# EAGLE design untitled (EAGLE 9.6.2)
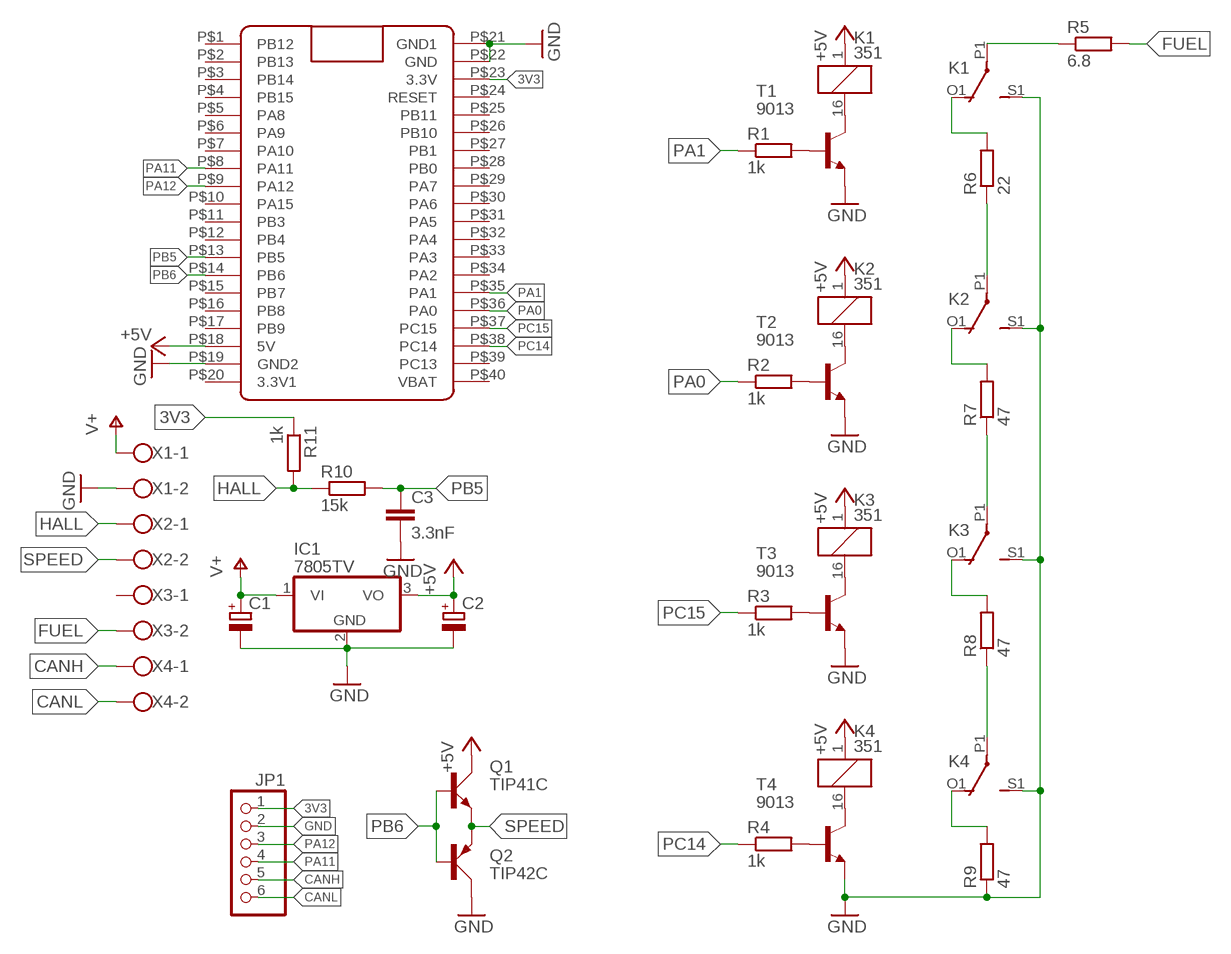
[diagram p0: schematic, sheet 1]

## Parts
C1  CPOL-EUE5-10.5  [E5-10,5]
C2  CPOL-EUE5-10.5  [E5-10,5]
C3  3.3nF  C-EU050-024X044  [C050-024X044]
IC1  7805TV  [TO220V]
JP1  PINHD-1X6  [1X06]
K1  351  [351]
K2  351  [351]
K3  351  [351]
K4  351  [351]
Q1  TIP41C  [TO220AV]
Q2  TIP42C  [TO220AV]
R1  1k  R-EU_0207/7  [0207/7]
R2  1k  R-EU_0207/7  [0207/7]
R3  1k  R-EU_0207/7  [0207/7]
R4  1k  R-EU_0207/7  [0207/7]
R5  6.8  R-EU_0207/7  [0207/7]
R6  22  R-EU_0207/7  [0207/7]
R7  47  R-EU_0207/7  [0207/7]
R8  47  R-EU_0207/7  [0207/7]
R9  47  R-EU_0207/7  [0207/7]
R10  15k  R-EU_0207/7  [0207/7]
R11  1k  R-EU_0207/7  [0207/7]
T1  9013  -NPN-TO92-EBC  [TO92-EBC]
T2  9013  -NPN-TO92-EBC  [TO92-EBC]
T3  9013  -NPN-TO92-EBC  [TO92-EBC]
T4  9013  -NPN-TO92-EBC  [TO92-EBC]
U$1  BLUE_PILL  [BLUE_PILL]
X1  W237-102  [W237-102]
X2  W237-102  [W237-102]
X3  W237-102  [W237-102]
X4  W237-102  [W237-102]

## Nets
3V3: JP1.1 R11.1 U$1.P$23(3.3V)
+5V: C2.+ IC1.3(VO) K1.1 K2.1 K3.1 K4.1 Q1.C U$1.P$18(5V)
CANH: JP1.5 X4.1
CANL: JP1.6 X4.2
FUEL: R5.2 X3.2
GND: C1.- C2.- C3.2 IC1.2(GND) JP1.2 K1.S1(2:S) K2.S1(2:S) K3.S1(2:S) K4.S1(2:S) Q2.C R9.1 T1.E T2.E T3.E T4.E U$1.P$19(GND2) U$1.P$21(GND1) U$1.P$22(GND) X1.2
HALL: R10.1 R11.2 X2.1
N$1: K1.P1(2:P) R5.1
N$3: K1.16 T1.C
N$4: R1.2 T1.B
N$5: K2.16 T2.C
N$6: R2.2 T2.B
N$7: K3.16 T3.C
N$8: R3.2 T3.B
N$9: K4.16 T4.C
N$10: R4.2 T4.B
N$11: K2.P1(2:P) R6.1
N$12: K1.O1(2:O) R6.2
N$13: K3.P1(2:P) R7.1
N$14: K2.O1(2:O) R7.2
N$15: K4.P1(2:P) R8.1
N$16: K3.O1(2:O) R8.2
N$18: K4.O1(2:O) R9.2
PA0: R2.1 U$1.P$36(PA0)
PA1: R1.1 U$1.P$35(PA1)
PA11: JP1.4 U$1.P$8(PA11)
PA12: JP1.3 U$1.P$9(PA12)
PB5: C3.1 R10.2 U$1.P$13(PB5)
PB6: Q1.B Q2.B U$1.P$14(PB6)
PC14: R4.1 U$1.P$38(PC14)
PC15: R3.1 U$1.P$37(PC15)
SPEED: Q1.E Q2.E X2.2
V+: C1.+ IC1.1(VI) X1.1
Unconnected: K1.O2(3:O) K1.P2(3:P) K1.S2(3:S) K2.O2(3:O) K2.P2(3:P) K2.S2(3:S) K3.O2(3:O) K3.P2(3:P) K3.S2(3:S) K4.O2(3:O) K4.P2(3:P) K4.S2(3:S) U$1.P$1(PB12) U$1.P$2(PB13) U$1.P$3(PB14) U$1.P$4(PB15) U$1.P$5(PA8) U$1.P$6(PA9) U$1.P$7(PA10) U$1.P$10(PA15) U$1.P$11(PB3) U$1.P$12(PB4) U$1.P$15(PB7) U$1.P$16(PB8) U$1.P$17(PB9) U$1.P$20(3.3V1) U$1.P$24(RESET) U$1.P$25(PB11) U$1.P$26(PB10) U$1.P$27(PB1) U$1.P$28(PB0) U$1.P$29(PA7) U$1.P$30(PA6) U$1.P$31(PA5) U$1.P$32(PA4) U$1.P$33(PA3) U$1.P$34(PA2) U$1.P$39(PC13) U$1.P$40(VBAT) X3.1

## Library data of the parts
C1 C2 = rcl:CPOL-EU: POLARIZED CAPACITOR, European symbol; SPICEPREFIX: C
C3 = rcl:C-EU: CAPACITOR, European symbol; SPICEPREFIX: C
IC1 = linear:78*: Positive VOLTAGE REGULATOR Source: http://cache.national.com/ds/LM/LM78L05.pdf http://www.fairchildsemi.com/ds/LM/LM7805.pdf
JP1 = pinhead:PINHD-1X6: PIN HEADER
K1-K4 = relay:351: RELAY 2 x switch, Omron; OC_FARNELL: unknown; OC_NEWARK: unknown
Q1 = transistor-power:TIP41C: NPN TRANSISTOR
Q2 = transistor-power:TIP42C: PNP TRANSISTOR
R1-R11 = rcl:R-EU_: RESISTOR, European symbol; SPICEPREFIX: R
T1-T4 = transistor:*-NPN-: NPN Transistror BF959 corrected 2008.03.06
U$1 = BluePill:BLUE_PILL
X1-X4 = con-wago-500:W237-102: WAGO SCREW CLAMP; MPN: 237-102; OC_FARNELL: unknown; OC_NEWARK: 70K9898

## Board
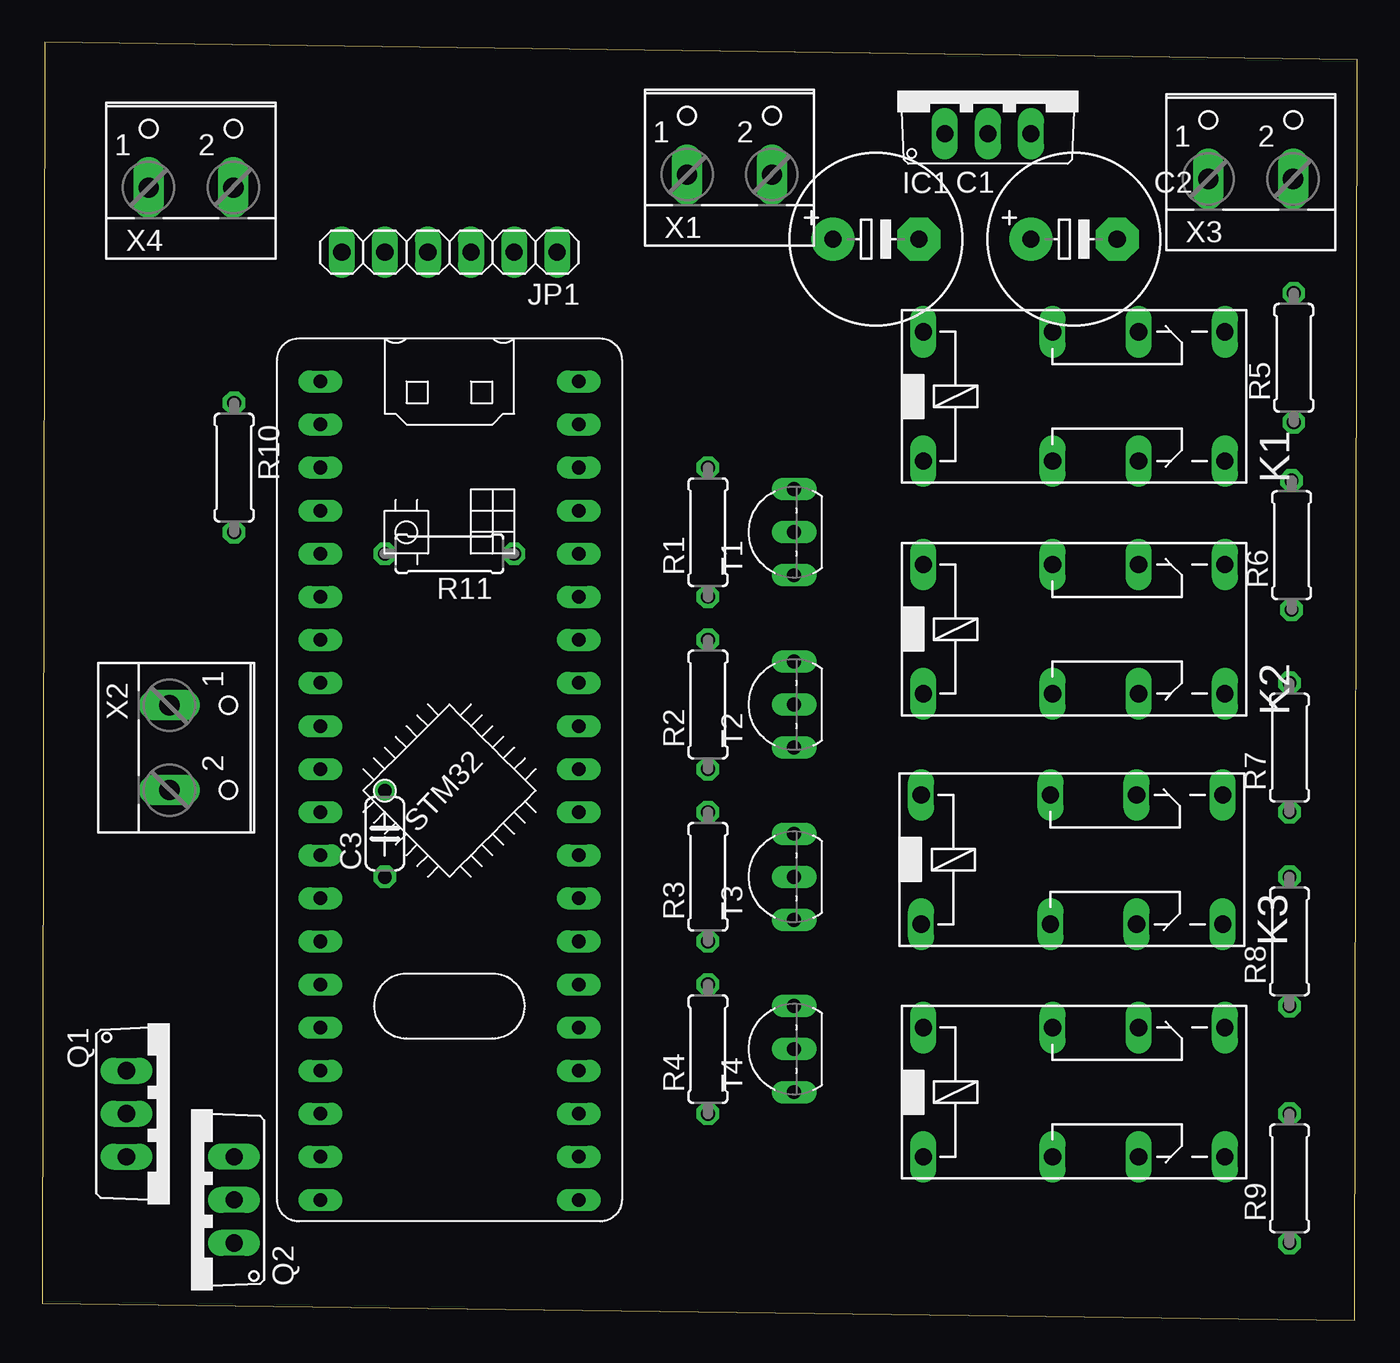
[diagram p1: board, top side]
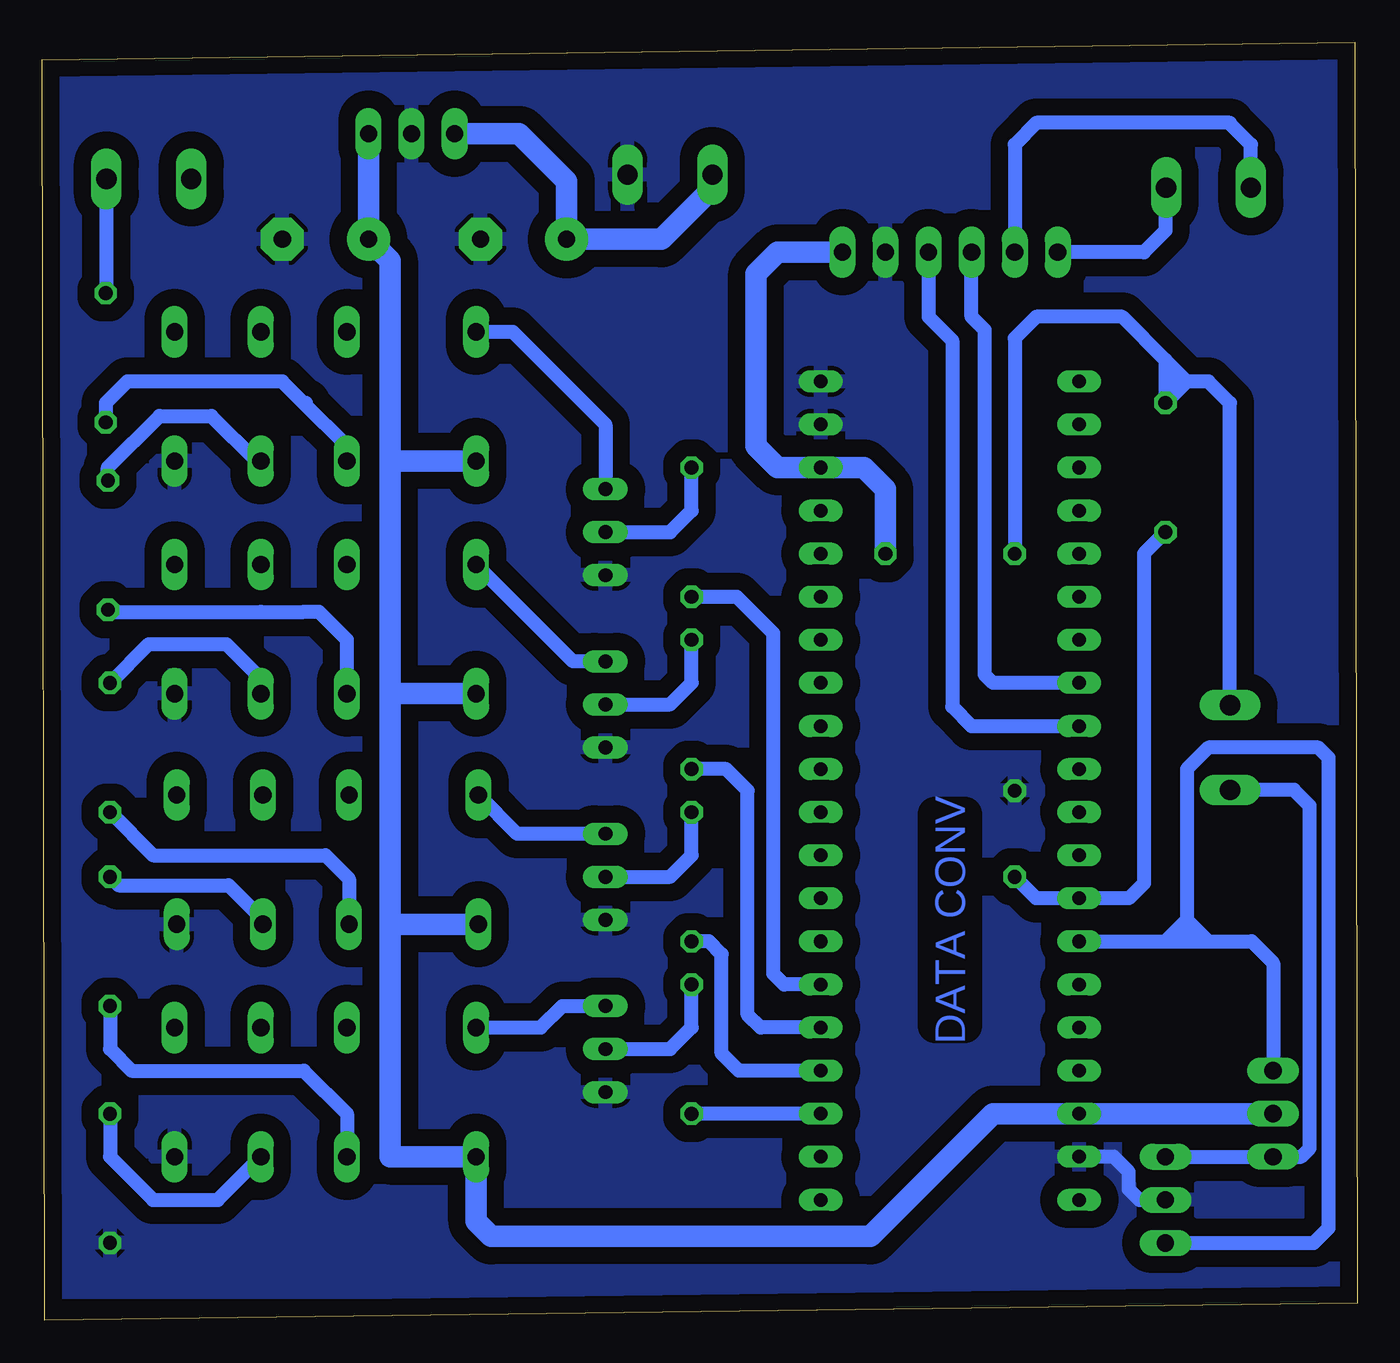
[diagram p2: board, bottom side, seen from below]

Size 77.52 x 75.36 mm. Coordinates in mm from the lower left corner, seen from the top.
Outline: 0,1.02 77.39,0 77.52,74.35 0.13,75.36 0,1.02
Copper layers (1*16): Top 0.035mm / dielectric 1.5mm / Bottom 0.035mm
Design rules "default": minimum track width 6mil, minimum drill 0.35mm, track to track 6mil, track to pad 6mil, pad to pad 6mil, via to via 6mil, smd to smd 6mil, copper to edge 40mil, drill to drill 6mil, minimum pad ring 10mil, minimum via ring 8mil, stop-mask expansion 4mil, vias tented up to drill 0mil, thermal gap 10mil

### Footprints (pad centres in the part's own frame; a part is rotated, then mirrored left to right if it is on the bottom)
E5-10,5 = drill 1.016 pad 2.54: + -2.54,0 | drill 1.016 pad 2.54 octagon: - 2.54,0
C050-024X044 = drill 0.813 octagon: 1 -2.54,0; 2 2.54,0
TO220V = drill 1.016 long: 1 -2.54,-2.54; 2 0,-2.54; 3 2.54,-2.54
1X06 = drill 1.016 long: 1 -6.35,0; 2 -3.81,0; 3 -1.27,0; 4 1.27,0; 5 3.81,0; 6 6.35,0
351 = drill 1.016 long: 1 -3.81,-3.81; 16 -3.81,3.81; O1 8.89,-3.81; O2 8.89,3.81; P1 3.81,-3.81; P2 3.81,3.81; S1 13.97,-3.81; S2 13.97,3.81
TO220AV = drill 1.016 long: B -2.54,-2.54; C 0,-2.54; E 2.54,-2.54
0207/7 = drill 0.813 octagon: 1 -3.81,0; 2 3.81,0
TO92-EBC = drill 0.813 long: B 0,-1.27; C 2.54,-1.27; E -2.54,-1.27
BLUE_PILL = drill 0.8 long: P$1 -7.62,15.24; P$2 -7.62,12.7; P$3 -7.62,10.16; P$4 -7.62,7.62; P$5 -7.62,5.08; P$6 -7.62,2.54; P$7 -7.62,0; P$8 -7.62,-2.54; P$9 -7.62,-5.08; P$10 -7.62,-7.62; P$11 -7.62,-10.16; P$12 -7.62,-12.7; P$13 -7.62,-15.24; P$14 -7.62,-17.78; P$15 -7.62,-20.32; P$16 -7.62,-22.86; P$17 -7.62,-25.4; P$18 -7.62,-27.94; P$19 -7.62,-30.48; P$20 -7.62,-33.02; P$21 7.62,15.24; P$22 7.62,12.7; P$23 7.62,10.16; P$24 7.62,7.62; P$25 7.62,5.08; P$26 7.62,2.54; P$27 7.62,0; P$28 7.62,-2.54; P$29 7.62,-5.08; P$30 7.62,-7.62; P$31 7.62,-10.16; P$32 7.62,-12.7; P$33 7.62,-15.24; P$34 7.62,-17.78; P$35 7.62,-20.32; P$36 7.62,-22.86; P$37 7.62,-25.4; P$38 7.62,-27.94; P$39 7.62,-30.48; P$40 7.62,-33.02
W237-102 = drill 1.194 long: 1 -2.5,-1.27; 2 2.5,-1.27

### Placement (x,y rotation side)
C1  49.15,63.75 0 top
C2  60.83,63.75 0 top
C3  20.19,28.7 90 top
IC1  55.75,72.52 0 top
JP1  24,62.99 180 top
K1  55.75,54.48 0 top
K2  55.75,40.77 0 top
K3  55.63,27.18 0 top
K4  55.75,13.46 0 top
Q1  7.49,12.19 270 top
Q2  8.76,7.11 90 top
R1  39.24,46.48 90 top
R2  39.24,36.32 90 top
R3  39.24,26.16 90 top
R4  39.24,16 90 top
R5  73.79,56.77 90 top
R6  73.66,45.72 90 top
R7  73.53,33.78 90 top
R8  73.53,22.35 90 top
R9  73.53,8.38 90 top
R10  11.3,50.29 270 top
R11  24,45.21 180 top
T1  43.05,46.48 90 top
T2  43.05,36.32 90 top
T3  43.05,26.16 90 top
T4  43.05,16 90 top
U$1  24,40.13 0 top
X1  40.51,68.83 0 top
X2  8.76,33.78 270 top
X3  71.25,68.58 0 top
X4  8.76,68.07 0 top

### Tracks (layer width: path | path; a pad name or v marks a point on that pad's centre or on a via)
3V3
  Bottom 1.27: JP1.1 34.16,62.99 35.43,61.72 35.43,51.56 34.16,50.29 U$1.P$23 29.08,50.29 27.81,49.02 R11.1
+5V
  Bottom 1.27: IC1.3 C2.+ 57.02,62.48 57.02,50.67 | 57.02,36.96 57.02,23.37 | 57.02,23.37 57.02,9.65 K4.1 51.94,5.84 51.05,4.95 28.7,4.95 21.46,12.19 U$1.P$18 Q1.C | K2.1 57.02,36.96 | K3.1 57.02,23.37 | 57.02,36.96 57.02,50.67 | K1.1 57.02,50.67
CANH
  Bottom 0.813: X4.1 6.26,69.34 7.49,70.57 7.49,70.61 18.92,70.61 20.19,69.34 JP1.5
CANL
  Bottom 0.813: X4.2 11.3,66.76 11.3,64.26 12.57,62.99 JP1.6
FUEL
  Bottom 0.813: X3.2 73.75,60.62 R5.2
GND
  Bottom 0.813: Q2.C 12.83,7.11 13.46,7.75 13.46,8.76 14.35,9.65 U$1.P$19
  pour Bottom (isolate 1.016): -0.13,74.42 -0.13,1.65 76.84,1.65 76.84,74.42
HALL
  Bottom 0.813: 7.53,36.32 X2.1 7.49,54.1 8.76,55.37 10.03,55.37 | R11.2 20.19,57.91 18.92,59.18 13.84,59.18 11.3,56.64 | 11.3,56.64 11.3,55.37 | 11.3,55.37 R10.1 10.03,55.37 | 11.3,55.37 10.03,55.37 | 10.03,55.37 11.3,56.64
N$1
  Bottom 0.813: R5.1 73.79,54.1 72.52,55.37 63.37,55.37 62.1,54.1 | 62.1,54.1 61.98,54.1 | 59.56,51.69 K1.P1 59.56,51.56 62.1,54.1
N$3
  Bottom 0.813: T1.C 44.32,52.83 49.78,58.29 K1.16
N$4
  Bottom 0.813: T1.B 40.51,46.48 39.24,47.75 R1.2
N$5
  Bottom 0.813: K2.16 46.23,38.86 T2.C
N$6
  Bottom 0.813: T2.B 40.51,36.32 39.24,37.59 R2.2
N$7
  Bottom 0.813: T3.C 49.53,28.7 K3.16
N$8
  Bottom 0.813: T3.B 40.51,26.16 39.24,27.43 R3.2
N$9
  Bottom 0.813: K4.16 48.13,17.27 46.86,18.54 T4.C
N$10
  Bottom 0.813: T4.B 40.51,16 39.24,17.27 R4.2
N$11
  Bottom 0.813: R6.1 73.53,41.78 64.64,41.78 62.1,41.78 61.21,41.78 59.56,40.13 K2.P1
N$12
  Bottom 0.813: R6.2 73.66,50.29 70.61,53.34 67.56,53.34 64.9,50.67 K1.O1
N$13
  Bottom 0.813: R7.1 70.99,27.43 60.83,27.43 59.44,26.04 K3.P1
N$14
  Bottom 0.813: R7.2 71.25,39.88 66.67,39.88 64.64,37.85 K2.O1
N$15
  Bottom 0.813: R8.1 73.53,16 72.26,14.73 62.1,14.73 59.56,12.19 K4.P1
N$16
  Bottom 0.813: R8.2 73.03,25.65 66.55,25.65 64.52,23.62 K3.O1
N$18
  Bottom 0.813: K4.O1 67.18,7.11 70.99,7.11 73.53,9.65 R9.2
PA0
  Bottom 0.813: U$1.P$36 35.18,17.27 35.94,18.03 35.94,31.24 37.21,32.51 R2.1
PA1
  Bottom 0.813: U$1.P$35 33.78,19.81 34.42,20.45 34.42,40.51 36.58,42.67 R1.1
PA11
  Bottom 0.813: U$1.P$8 21.46,37.59 21.97,38.1 21.97,58.42 22.73,59.18 JP1.4
PA12
  Bottom 0.813: JP1.3 25.27,59.18 23.88,57.78 23.88,36.2 22.73,35.05 U$1.P$9
PB5
  Bottom 0.813: C3.1 18.92,24.89 U$1.P$13 13.46,24.89 12.57,25.78 12.57,45.21 R10.2
PB6
  Bottom 0.813: Q1.B 4.95,21.08 6.22,22.35 8.76,22.35 | Q2.B 2.57,4.57 1.68,5.46 1.68,33.17 2.29,33.78 8.76,33.78 10.03,32.51 10.03,23.62 | U$1.P$14 11.3,22.35 | 11.3,22.35 10.03,22.35 | 10.03,22.35 8.76,22.35 | 10.03,23.62 10.03,22.35 | 11.3,22.35 10.03,23.62 | 10.03,23.62 8.76,22.35
PC14
  Bottom 0.813: U$1.P$38 R4.1
PC15
  Bottom 0.813: U$1.P$37 36.45,14.73 37.47,15.75 37.47,21.59 38.23,22.35 R3.1
SPEED
  Bottom 0.813: Q2.E Q1.E 3.3,9.65 2.79,10.16 2.79,30.35 3.72,31.28 X2.2
V+
  Bottom 1.27: X1.1 38.01,66.76 41.02,63.75 C1.+ 46.61,67.18 49.4,69.98 IC1.1

### Text on the board
Bottom: DATA CONV